# EAGLE design Dual LPF V1.2 Bottom (EAGLE 9.3.0)
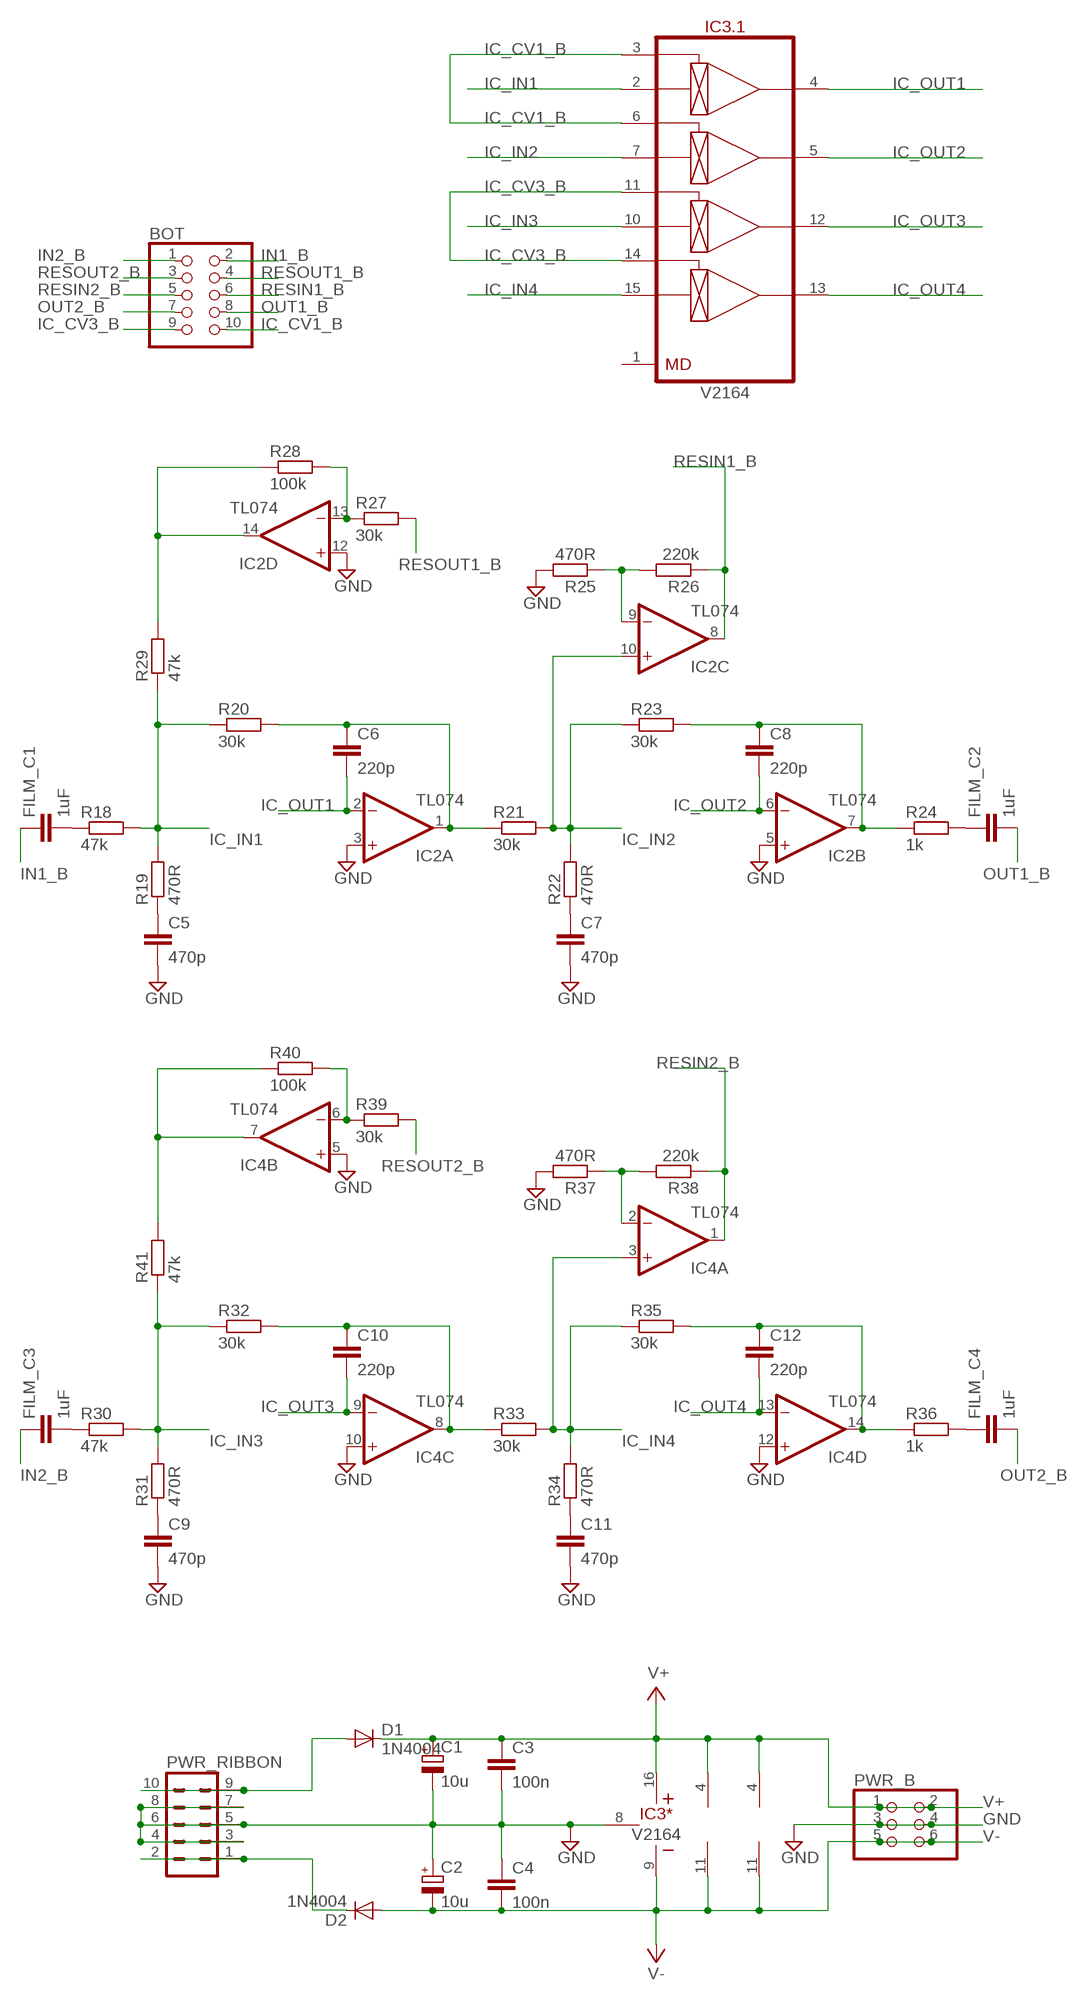
[diagram p0: schematic, sheet 1]

## Parts
BOT  PINHD-2X5  [2X05]
C1  10u  CPOL-EUE5-10.5  [E5-10,5]
C2  10u  CPOL-EUE5-10.5  [E5-10,5]
C3  100n  C-EU050-024X044  [C050-024X044]
C4  100n  C-EU050-024X044  [C050-024X044]
C5  470p  C-EU050-024X044  [C050-024X044]
C6  220p  C-EU050-024X044  [C050-024X044]
C7  470p  C-EU050-024X044  [C050-024X044]
C8  220p  C-EU050-024X044  [C050-024X044]
C9  470p  C-EU050-024X044  [C050-024X044]
C10  220p  C-EU050-024X044  [C050-024X044]
C11  470p  C-EU050-024X044  [C050-024X044]
C12  220p  C-EU050-024X044  [C050-024X044]
D1  1N4004  [DO41-10]
D2  1N4004  [DO41-10]
FILM_C1  1uF  C-EU050-045X075  [C050-045X075]
FILM_C2  1uF  C-EU050-045X075  [C050-045X075]
FILM_C3  1uF  C-EU050-045X075  [C050-045X075]
FILM_C4  1uF  C-EU050-045X075  [C050-045X075]
IC2  TL074  TL074_  [DIL14]
IC3  V2164  V2164D  [DIP-16]
IC4  TL074  TL074_  [DIL14]
PWR_B  PINHD-2X3  [2X03]
PWR_RIBBON  EURO_POWER_HEADERFAT_PADS  [EURO_PWR_HEADER_FAT]
R18  47k  R-EU_0207/7  [0207/7]
R19  470R  R-EU_0207/7  [0207/7]
R20  30k  R-EU_0207/7  [0207/7]
R21  30k  R-EU_0207/7  [0207/7]
R22  470R  R-EU_0207/7  [0207/7]
R23  30k  R-EU_0207/7  [0207/7]
R24  1k  R-EU_0207/7  [0207/7]
R25  470R  R-EU_0207/7  [0207/7]
R26  220k  R-EU_0207/7  [0207/7]
R27  30k  R-EU_0207/7  [0207/7]
R28  100k  R-EU_0207/7  [0207/7]
R29  47k  R-EU_0207/7  [0207/7]
R30  47k  R-EU_0207/7  [0207/7]
R31  470R  R-EU_0207/7  [0207/7]
R32  30k  R-EU_0207/7  [0207/7]
R33  30k  R-EU_0207/7  [0207/7]
R34  470R  R-EU_0207/7  [0207/7]
R35  30k  R-EU_0207/7  [0207/7]
R36  1k  R-EU_0207/7  [0207/7]
R37  470R  R-EU_0207/7  [0207/7]
R38  220k  R-EU_0207/7  [0207/7]
R39  30k  R-EU_0207/7  [0207/7]
R40  100k  R-EU_0207/7  [0207/7]
R41  47k  R-EU_0207/7  [0207/7]

## Nets
GND: C1.- C2.+ C3.2 C4.1 C5.2 C7.2 C9.2 C11.2 IC2.3(A:+IN) IC2.5(B:+IN) IC2.12(D:+IN) IC3.8(*:GND) IC4.5(B:+IN) IC4.10(C:+IN) IC4.12(D:+IN) PWR_B.3 PWR_B.4 PWR_RIBBON.3 PWR_RIBBON.4 PWR_RIBBON.5 PWR_RIBBON.6 PWR_RIBBON.7 PWR_RIBBON.8 R25.2 R37.2
IC_CV1_B: BOT.10 IC3.3(.1:CV1) IC3.6(.1:CV2)
IC_CV3_B: BOT.9 IC3.11(.1:CV3) IC3.14(.1:CV4)
IC_IN1: IC3.2(.1:IN1) R18.2 R19.2 R20.1 R29.1
IC_IN2: IC2.10(C:+IN) IC3.7(.1:IN2) R21.2 R22.2 R23.1
IC_IN3: IC3.10(.1:IN3) R30.2 R31.2 R32.1 R41.1
IC_IN4: IC3.15(.1:IN4) IC4.3(A:+IN) R33.2 R34.2 R35.1
IC_OUT1: C6.2 IC2.2(A:-IN) IC3.4(.1:OUT1)
IC_OUT2: C8.2 IC2.6(B:-IN) IC3.5(.1:OUT2)
IC_OUT3: C10.2 IC3.12(.1:OUT3) IC4.9(C:-IN)
IC_OUT4: C12.2 IC3.13(.1:OUT4) IC4.13(D:-IN)
IN1_B: BOT.2 FILM_C1.1
IN2_B: BOT.1 FILM_C3.1
N$14: C6.1 IC2.1(A:OUT) R20.2 R21.1
N$18: FILM_C1.2 R18.1
N$19: C5.1 R19.1
N$20: C7.1 R22.1
N$21: C8.1 IC2.7(B:OUT) R23.2 R24.1
N$22: FILM_C2.1 R24.2
N$25: IC2.9(C:-IN) R25.1 R26.2
N$26: IC2.14(D:OUT) R28.1 R29.2
N$28: IC2.13(D:-IN) R27.1 R28.2
N$30: D1.A PWR_RIBBON.9 PWR_RIBBON.10
N$32: FILM_C3.2 R30.1
N$33: C9.1 R31.1
N$34: C10.1 IC4.8(C:OUT) R32.2 R33.1
N$35: C11.1 R34.1
N$36: C12.1 IC4.14(D:OUT) R35.2 R36.1
N$37: FILM_C4.1 R36.2
N$38: D2.C PWR_RIBBON.1 PWR_RIBBON.2
N$40: IC4.2(A:-IN) R37.1 R38.2
N$42: IC4.6(B:-IN) R39.1 R40.2
N$43: IC4.7(B:OUT) R40.1 R41.2
OUT1_B: BOT.8 FILM_C2.2
OUT2_B: BOT.7 FILM_C4.2
RESIN1_B: BOT.6 IC2.8(C:OUT) R26.1
RESIN2_B: BOT.5 IC4.1(A:OUT) R38.1
RESOUT1_B: BOT.4 R27.2
RESOUT2_B: BOT.3 R39.2
V+: C1.+ C3.1 D1.C IC2.4(P:V+) IC3.16(*:V+) IC4.4(P:V+) PWR_B.1 PWR_B.2
V-: C2.- C4.2 D2.A IC2.11(P:V-) IC3.9(*:V-) IC4.11(P:V-) PWR_B.5 PWR_B.6
Unconnected: IC3.1(.1:MD)

## Library data of the parts
BOT = pinhead:PINHD-2X5: PIN HEADER
C1 C2 = resistor:CPOL-EU: POLARIZED CAPACITOR, European symbol
C3-C12 FILM_C1-FILM_C4 = resistor:C-EU: CAPACITOR, European symbol
D1 D2 = diode:1N4004: DIODE general purpose rectifier, 1 A
IC2 IC4 = MusicThingModular:TL074: Generic Quad Op Amp
IC3 = ic-coolaudio:V2164
PWR_B = pinhead:PINHD-2X3: PIN HEADER
PWR_RIBBON = MusicThingModular:EURO_POWER_HEADER: Power Header 10 pin power header for Eurorack Power Supplies Variants with fatter pads for easier soldering, and the LOCK variant which has 5mil offset pins to hold the component in place before soldering
R18-R41 = resistor:R-EU_: RESISTOR, European symbol

## Board
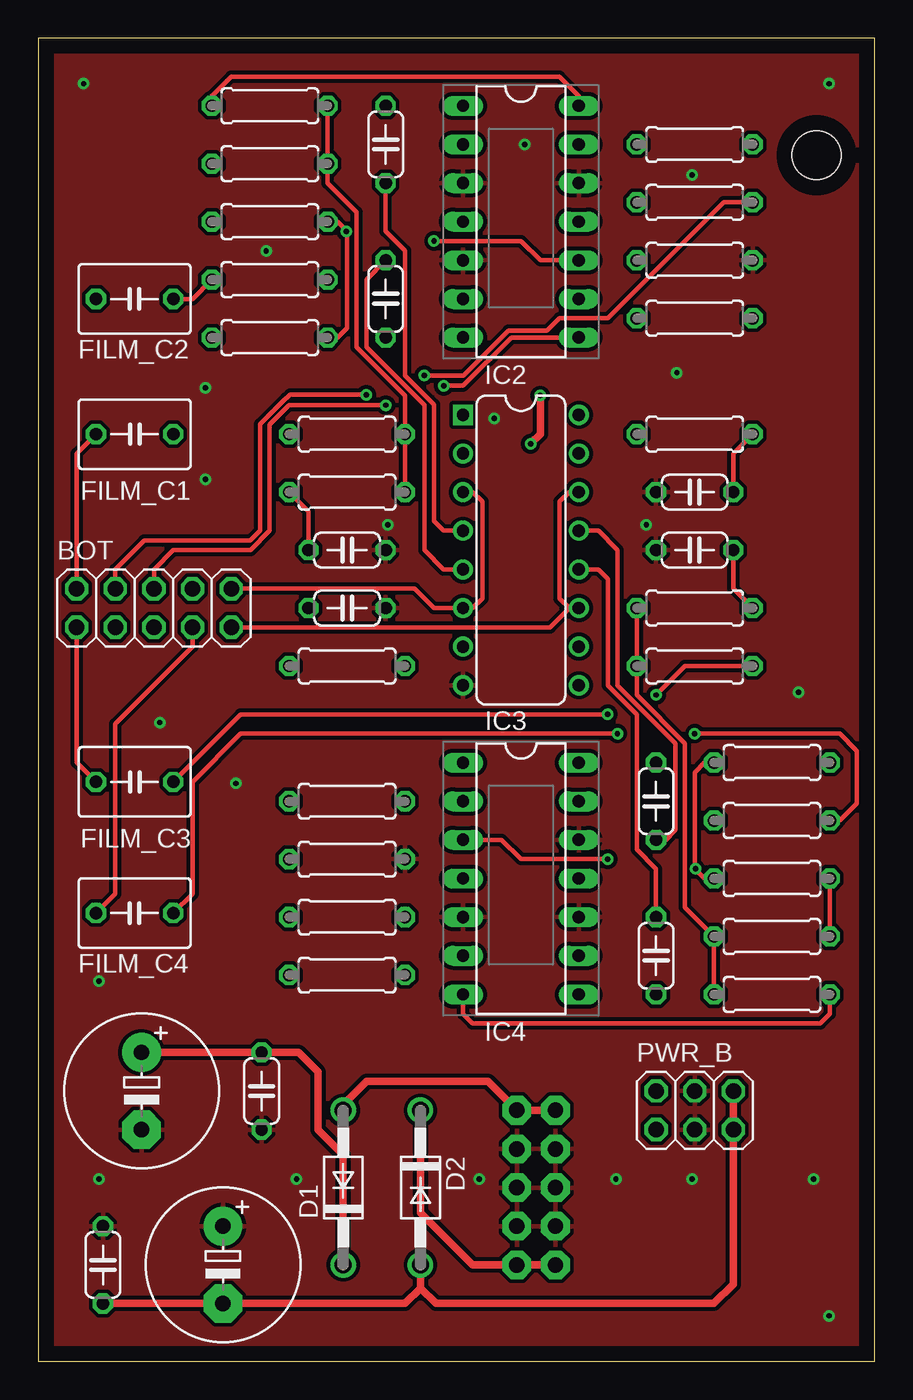
[diagram p1: board, top side]
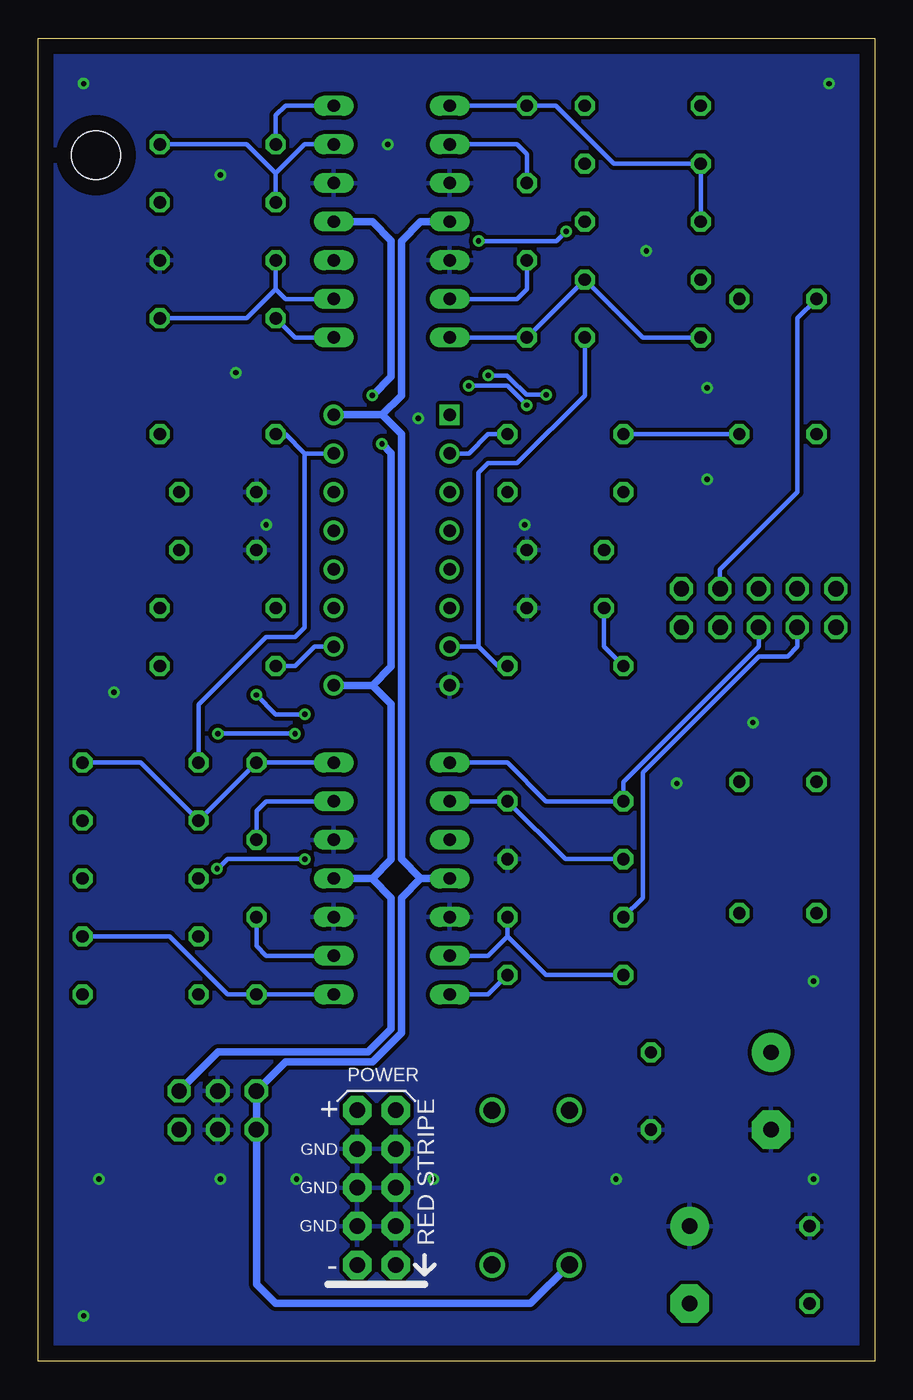
[diagram p2: board, bottom side, seen from below]

Size 55 x 87 mm. Coordinates in mm from the lower left corner, seen from the top.
Outline: 0,0 55,0 55,87 0,87 0,0
Copper layers (1*16): Top 0.035mm / dielectric 1.5mm / Bottom 0.035mm
Design rules "default": minimum track width 6mil, minimum drill 0.35mm, track to track 6mil, track to pad 6mil, pad to pad 6mil, via to via 6mil, smd to smd 6mil, copper to edge 40mil, drill to drill 6mil, minimum pad ring 10mil, minimum via ring 8mil, stop-mask expansion 4mil, vias tented up to drill 0mil, thermal gap 10mil
Holes 3.2 mm at 51.19,79.3

### Footprints (pad centres in the part's own frame; a part is rotated, then mirrored left to right if it is on the bottom)
2X05 = drill 1.016 octagon: 1 -5.08,-1.27; 2 -5.08,1.27; 3 -2.54,-1.27; 4 -2.54,1.27; 5 0,-1.27; 6 0,1.27; 7 2.54,-1.27; 8 2.54,1.27; 9 5.08,-1.27; 10 5.08,1.27
E5-10,5 = drill 1.016 pad 2.54: + -2.54,0 | drill 1.016 pad 2.54 octagon: - 2.54,0
C050-024X044 = drill 0.813 octagon: 1 -2.54,0; 2 2.54,0
DO41-10 = drill 1.118: A 5.08,0; C -5.08,0
C050-045X075 = drill 0.813 octagon: 1 -2.54,0; 2 2.54,0
DIL14 = drill 0.813 long: 1 -7.62,-3.81; 2 -5.08,-3.81; 3 -2.54,-3.81; 4 0,-3.81; 5 2.54,-3.81; 6 5.08,-3.81; 7 7.62,-3.81; 8 7.62,3.81; 9 5.08,3.81; 10 2.54,3.81; 11 0,3.81; 12 -2.54,3.81; 13 -5.08,3.81; 14 -7.62,3.81
DIP-16 = drill 0.813 square: 1 -8.89,-3.81 | drill 0.813: 2 -6.35,-3.81; 3 -3.81,-3.81; 4 -1.27,-3.81; 5 1.27,-3.81; 6 3.81,-3.81; 7 6.35,-3.81; 8 8.89,-3.81; 9 8.89,3.81; 10 6.35,3.81; 11 3.81,3.81; 12 1.27,3.81; 13 -1.27,3.81; 14 -3.81,3.81; 15 -6.35,3.81; 16 -8.89,3.81
2X03 = drill 1.016 octagon: 1 -2.54,-1.27; 2 -2.54,1.27; 3 0,-1.27; 4 0,1.27; 5 2.54,-1.27; 6 2.54,1.27
EURO_PWR_HEADER_FAT = drill 1.016 pad 1.88 octagon: 1 -5.08,-1.27; 2 -5.08,1.27; 3 -2.54,-1.27; 4 -2.54,1.27; 5 0,-1.27; 6 0,1.27; 7 2.54,-1.27; 8 2.54,1.27; 9 5.08,-1.27; 10 5.08,1.27
0207/7 = drill 0.813 octagon: 1 -3.81,0; 2 3.81,0

### Placement (x,y rotation side)
BOT  7.62,49.53 0 top
C1  6.81,17.78 270 top
C2  12.16,6.35 270 top
C3  14.7,17.78 270 top
C4  4.27,6.35 270 top
C5  20.32,53.34 0 top
C6  22.86,80.01 270 top
C7  20.32,49.53 0 top
C8  22.86,69.85 90 top
C9  43.18,53.34 180 top
C10  40.64,26.67 90 top
C11  43.18,57.15 180 top
C12  40.64,36.83 270 top
D1  20.07,11.43 90 top
D2  25.15,11.43 270 top
FILM_C1  6.35,60.96 0 top
FILM_C2  6.35,69.85 180 top
FILM_C3  6.35,38.1 0 top
FILM_C4  6.35,29.48 180 top
IC2  31.75,74.93 270 top
IC3  31.75,53.34 270 top
IC4  31.75,31.75 270 top
PWR_B  43.18,16.51 0 top
PWR_RIBBON  32.75,11.43 90 bottom
R18  20.32,60.96 0 top
R19  20.32,57.15 0 top
R20  15.24,78.74 180 top
R21  15.24,74.93 0 top
R22  20.32,45.72 0 top
R23  15.24,67.31 180 top
R24  15.24,71.12 180 top
R25  43.18,72.39 0 top
R26  43.18,68.58 0 top
R27  43.18,76.2 0 top
R28  43.18,80.01 0 top
R29  15.24,82.55 180 top
R30  43.18,45.72 180 top
R31  43.18,49.53 180 top
R32  48.26,27.94 0 top
R33  48.26,31.75 180 top
R34  43.18,60.96 180 top
R35  48.26,39.37 0 top
R36  48.26,35.56 0 top
R37  20.32,33.02 0 top
R38  20.32,36.83 0 top
R39  20.32,29.21 180 top
R40  20.32,25.4 180 top
R41  48.26,24.13 0 top

### Tracks (layer width: path | path; a pad name or v marks a point on that pad's centre or on a via)
GND  (via drill 0.35)
  other vias: 3,84 52,84 52,3 4,12 17,12 29,12 38,12 43,12 51,12 4,25 13,38 8,42 50,44 42,65 32,80 30,62 11,58 11,64 15,73 43,78 23,55 40,55
  pour Top (isolate 0.254): 0,87 0,0 55,0 55,87
  pour Bottom (isolate 0.254): 0,87 0,0 55,0 55,87
IC_CV1_B
  Top 0.305: BOT.10 24.77,50.8 26.04,49.53 IC3.6 28.57,49.53 29.21,50.17 29.21,56.52 28.57,57.15 IC3.3
IC_CV3_B
  Top 0.305: BOT.9 33.66,48.26 34.92,49.53 | IC3.11 34.92,49.53 | 34.92,49.53 34.29,50.17 34.29,56.52 34.92,57.15 IC3.14
IC_IN1
  Top 0.305: R19.2 R18.2 24.13,63.5 20.96,66.67 20.96,75.56 19.05,77.47 R20.1 R29.1
  Bottom 0.305: R18.2 25.4,60.96 26.67,59.69 IC3.2
IC_IN2  (via drill 0.35)
  Top 0.305: R21.2 19.69,74.93 20.32,74.3 | 20.32,74.3 20.32,67.94 19.69,67.31 R23.1 | 20.32,74.3 v20.27,74.3 | v26.04,73.66 31.75,73.66 33.02,72.39 IC2.10
  Bottom 0.305: R22.2 24.77,45.72 26.04,46.99 | 26.04,46.99 IC3.7 | v20.27,74.3 20.91,73.66 v26.04,73.66 | 26.04,46.99 26.04,58.42 25.4,59.05 23.5,59.05 19.05,63.5 R23.1
IC_IN3
  Top 0.305: R31.2 R30.2 39.37,43.81 42.54,40.64 42.54,29.85 R32.1 R41.1
  Bottom 0.305: IC3.10 36.83,46.99 38.1,45.72 R30.2
IC_IN4  (via drill 0.35)
  Top 0.305: R33.2 43.81,31.75 43.18,32.39 | 43.18,32.39 43.18,38.73 43.81,39.37 R35.1 | 43.18,32.39 v43.23,32.39 | v37.46,33.02 31.75,33.02 30.48,34.29 IC4.3
  Bottom 0.305: R34.2 38.73,60.96 37.46,59.69 | 37.46,59.69 IC3.15 | 37.46,59.69 37.46,48.26 38.1,47.62 40,47.62 44.45,43.18 R35.1 | v43.23,32.39 43.18,32.39 42.54,33.02 v37.46,33.02
IC_OUT1
  Top 0.305: C6.2 22.86,74.3 24.13,73.02 24.13,64.79 26.04,62.89 26.04,55.24 26.67,54.61 IC3.4
  Bottom 0.305: C6.2 22.86,79.38 23.5,80.01 IC2.2
IC_OUT2
  Top 0.305: C8.2 21.59,71.12 21.59,66.69 25.4,62.88 25.4,53.34 26.67,52.07 IC3.5
  Bottom 0.305: C8.2 22.86,70.48 23.5,69.85 IC2.6
IC_OUT3
  Top 0.305: IC3.12 36.83,52.07 37.46,51.44 37.46,44.43 39.37,42.52 39.37,33.66 40.64,32.39 C10.2
  Bottom 0.305: C10.2 40.64,27.31 40,26.67 IC4.9
IC_OUT4
  Top 0.305: C12.2 41.27,34.29 41.91,34.92 41.91,40.63 38.1,44.44 38.1,53.34 36.83,54.61 IC3.13
  Bottom 0.305: IC4.13 40,36.83 40.64,36.2 C12.2
IN1_B
  Top 0.305: BOT.2 2.54,59.69 FILM_C1.1
IN2_B
  Top 0.305: BOT.1 2.54,39.37 FILM_C3.1
N$14
  Bottom 0.305: IC2.1 C6.1 20.96,82.55 17.14,78.74 R20.2 R21.1
N$18
  Bottom 0.305: FILM_C1.2 R18.1
N$19
  Top 0.305: R19.1 17.78,55.88 C5.1
N$20
  Bottom 0.305: R22.1 17.78,46.99 C7.1
N$21
  Bottom 0.305: IC2.7 C8.1 R24.1 15.24,67.31 R23.2
N$22
  Top 0.305: FILM_C2.1 10.16,69.85 R24.2
N$25
  Bottom 0.305: 39.37,70.48 38.73,69.85 IC2.9 | 39.37,70.48 R25.1 | 39.37,70.48 41.27,68.58 R26.2
N$26
  Top 0.305: R29.2 11.43,83.19 12.7,84.45 34.29,84.45 35.56,83.19 IC2.14
  Bottom 0.305: IC2.14 38.73,82.55 39.37,81.91 R28.1
N$28
  Bottom 0.305: IC2.13 37.46,80.01 39.37,78.11 | 39.37,78.11 R27.1 | 39.37,78.11 41.27,80.01 R28.2
N$30
  Top 0.508: D1.A 20.32,16.76 20.32,17.14 21.59,18.41 29.57,18.41 PWR_RIBBON.9 PWR_RIBBON.10
N$32  (via drill 0.35)
  Top 0.305: R30.1 42.54,45.72 v40.64,43.81 | v37.46,42.55 13.33,42.55 FILM_C3.2
  Bottom 0.305: v40.64,43.81 39.37,42.55 v37.46,42.55
N$33
  Top 0.305: C9.1 45.72,50.8 R31.1
N$34
  Top 0.305: R33.1 R32.2
  Bottom 0.305: IC4.8 C10.1 42.54,24.13 46.35,27.94 R32.2
N$35
  Top 0.305: C11.1 45.72,59.69 R34.1
N$36
  Bottom 0.305: IC4.14 C12.1 R36.1 48.26,39.37 R35.2
N$37  (via drill 0.35)
  Top 0.305: FILM_C4.1 10.16,30.75 10.16,38.1 13.33,41.28 v38.1,41.28 | v43.18,41.28 52.7,41.28 53.83,40.15 53.83,36.69 52.7,35.56 R36.2
  Bottom 0.305: v38.1,41.28 v43.18,41.28
N$38
  Top 0.508: D2.C 25.15,9.78 28.57,6.35 PWR_RIBBON.1 PWR_RIBBON.2
N$40
  Bottom 0.305: IC4.2 R38.2 20.32,33.02 R37.1
N$42
  Bottom 0.305: R39.1 24.13,27.94 | 24.13,27.94 25.4,26.67 IC4.6 | 24.13,27.94 21.59,25.4 R40.2
N$43
  Top 0.305: IC4.7 27.94,22.86 28.57,22.22 51.43,22.22 52.07,22.86 R41.2
  Bottom 0.305: R40.1 25.4,24.13 IC4.7
OUT1_B
  Bottom 0.305: BOT.8 10.16,52.07 5.08,57.15 5.08,68.58 FILM_C2.2
OUT2_B
  Top 0.305: BOT.7 10.16,46.99 5.08,41.91 5.08,30.75 FILM_C4.2
RESIN1_B  (via drill 0.35)
  Top 0.305: BOT.6 7.62,52.07 8.89,53.34 13.97,53.34 15.24,54.61 15.24,61.59 16.51,62.86 v22.86,62.86 | v26.67,64.13 27.94,64.13 31.11,67.31 IC2.8
  Bottom 0.305: v22.86,62.86 24.13,64.13 v26.67,64.13 | IC2.8 38.1,67.31 R26.1
RESIN2_B
  Bottom 0.305: IC4.1 24.13,39.37 21.59,36.83 R38.1 16.51,38.1 7.62,46.99 BOT.5
RESOUT1_B  (via drill 0.35)
  Top 0.305: BOT.4 5.08,52.07 6.98,53.97 13.96,53.97 14.6,54.62 14.6,61.61 16.32,63.32 16.33,63.32 16.56,63.55 v21.59,63.55 | v25.4,64.82 27.98,64.82 30.93,67.77 33.48,67.77 34.29,68.58 37.46,68.58 45.09,76.2 R27.2
  Bottom 0.305: v21.59,63.55 22.9,63.55 23.94,64.59 23.95,64.59 24.18,64.82 v25.4,64.82
RESOUT2_B
  Bottom 0.305: BOT.3 5.08,46.99 5.71,46.36 7.61,46.36 15.24,38.72 15.24,30.48 R39.2
V+
  Top 0.508: D1.C 20.07,13.59 18.42,15.24 18.42,19.05 17.14,20.32 C3.1 C1.+
  Bottom 0.508: D1.C 22.61,3.81 39.37,3.81 40.64,5.08 PWR_B.1 PWR_B.2 38.73,19.68 33.02,19.68 31.11,21.59 31.11,30.48 29.85,31.75 | IC4.4 29.85,31.75 | 29.85,31.75 31.11,33.02 31.11,60.96 32.38,62.23 | 32.38,62.23 IC3.16 | 32.38,62.23 31.11,63.5 31.11,73.66 29.85,74.93 IC2.4
V-  (via drill 0.35)
  Top 0.508: C4.2 C2.- 24.13,3.81 25.15,4.83 | 25.15,4.83 D2.A | 25.15,4.83 26.16,3.81 44.45,3.81 45.72,5.08 PWR_B.5 PWR_B.6 | v32.38,60.33 33.02,60.96 v33.02,63.5
  Bottom 0.508: PWR_B.6 43.16,20.35 33.29,20.35 31.78,21.86 31.78,30.48 33.02,31.72 33.02,31.75 | 33.02,31.75 IC4.11 | 33.02,31.75 31.78,33 31.78,43.2 33.02,44.45 | 33.02,44.45 IC3.9 | 33.02,44.45 31.78,45.7 31.78,59.72 v32.38,60.33 | v33.02,63.5 31.78,64.74 31.78,73.69 33.02,74.93 IC2.11

### Text on the board
tValues: V2164 | Main Board / Dual Dreadful VCF V1.3 / Tom Evans 2019 / CC BY 4.0